# EasyEDA Pro project ProPrj_主稳压电路_2025-12-27.epro, board PCB7
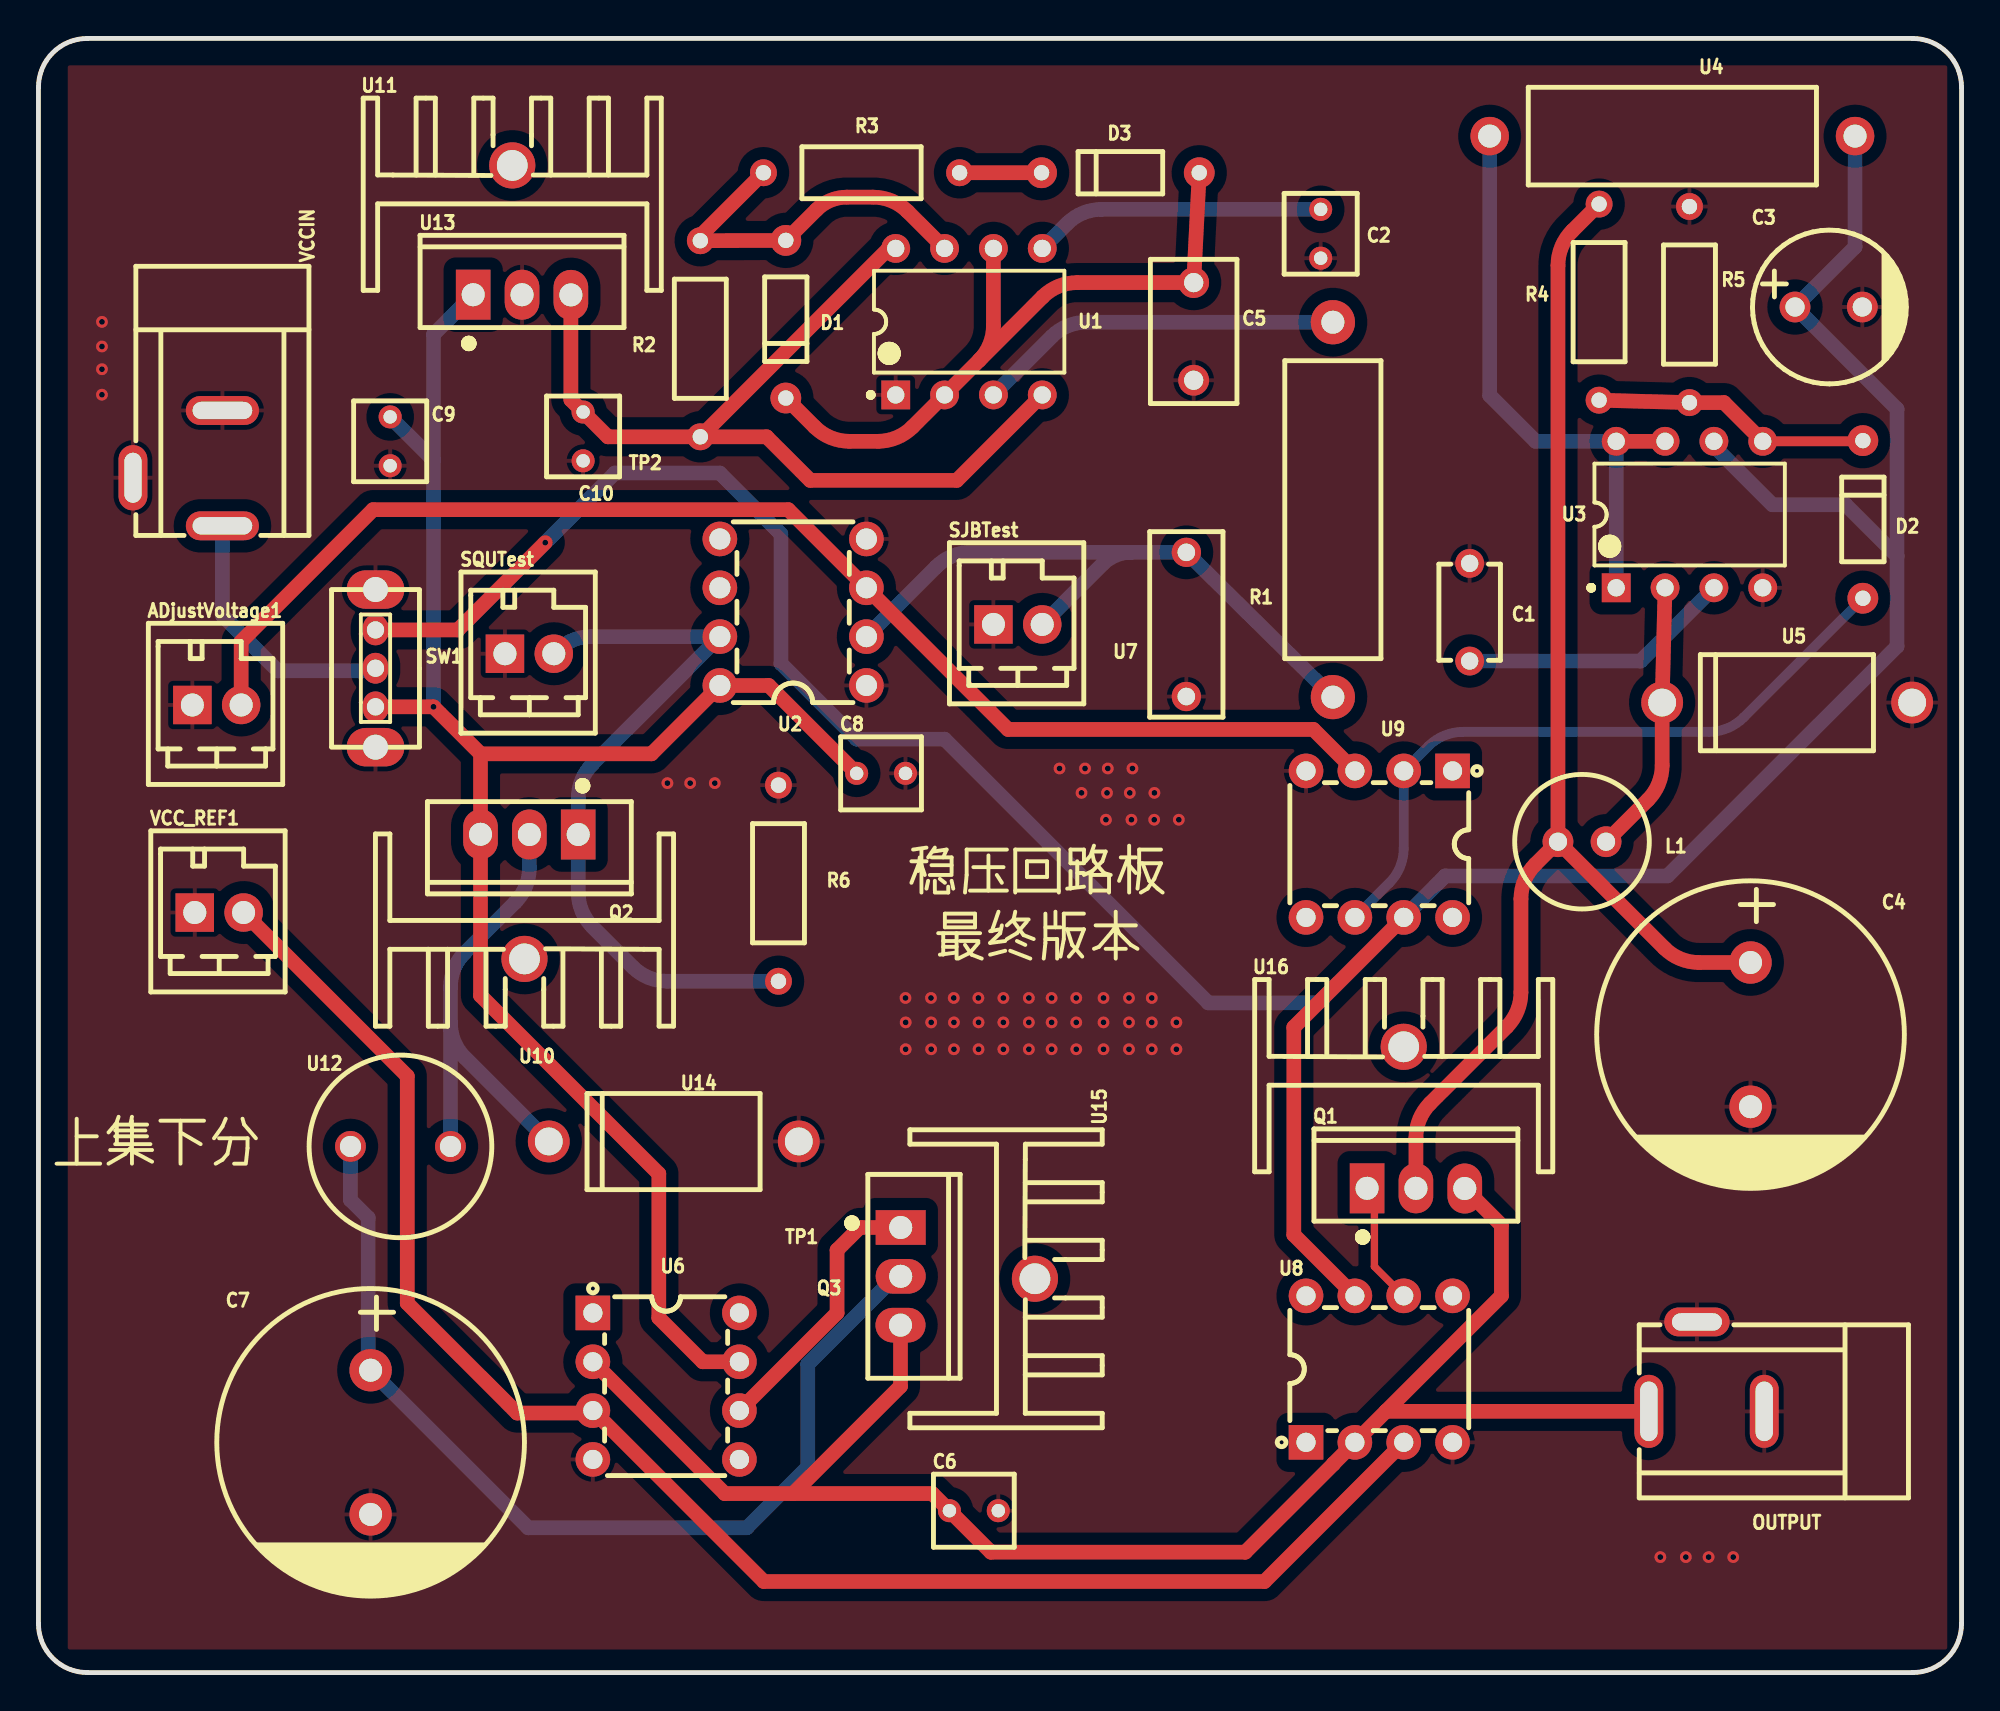
[diagram p5: board, top side]
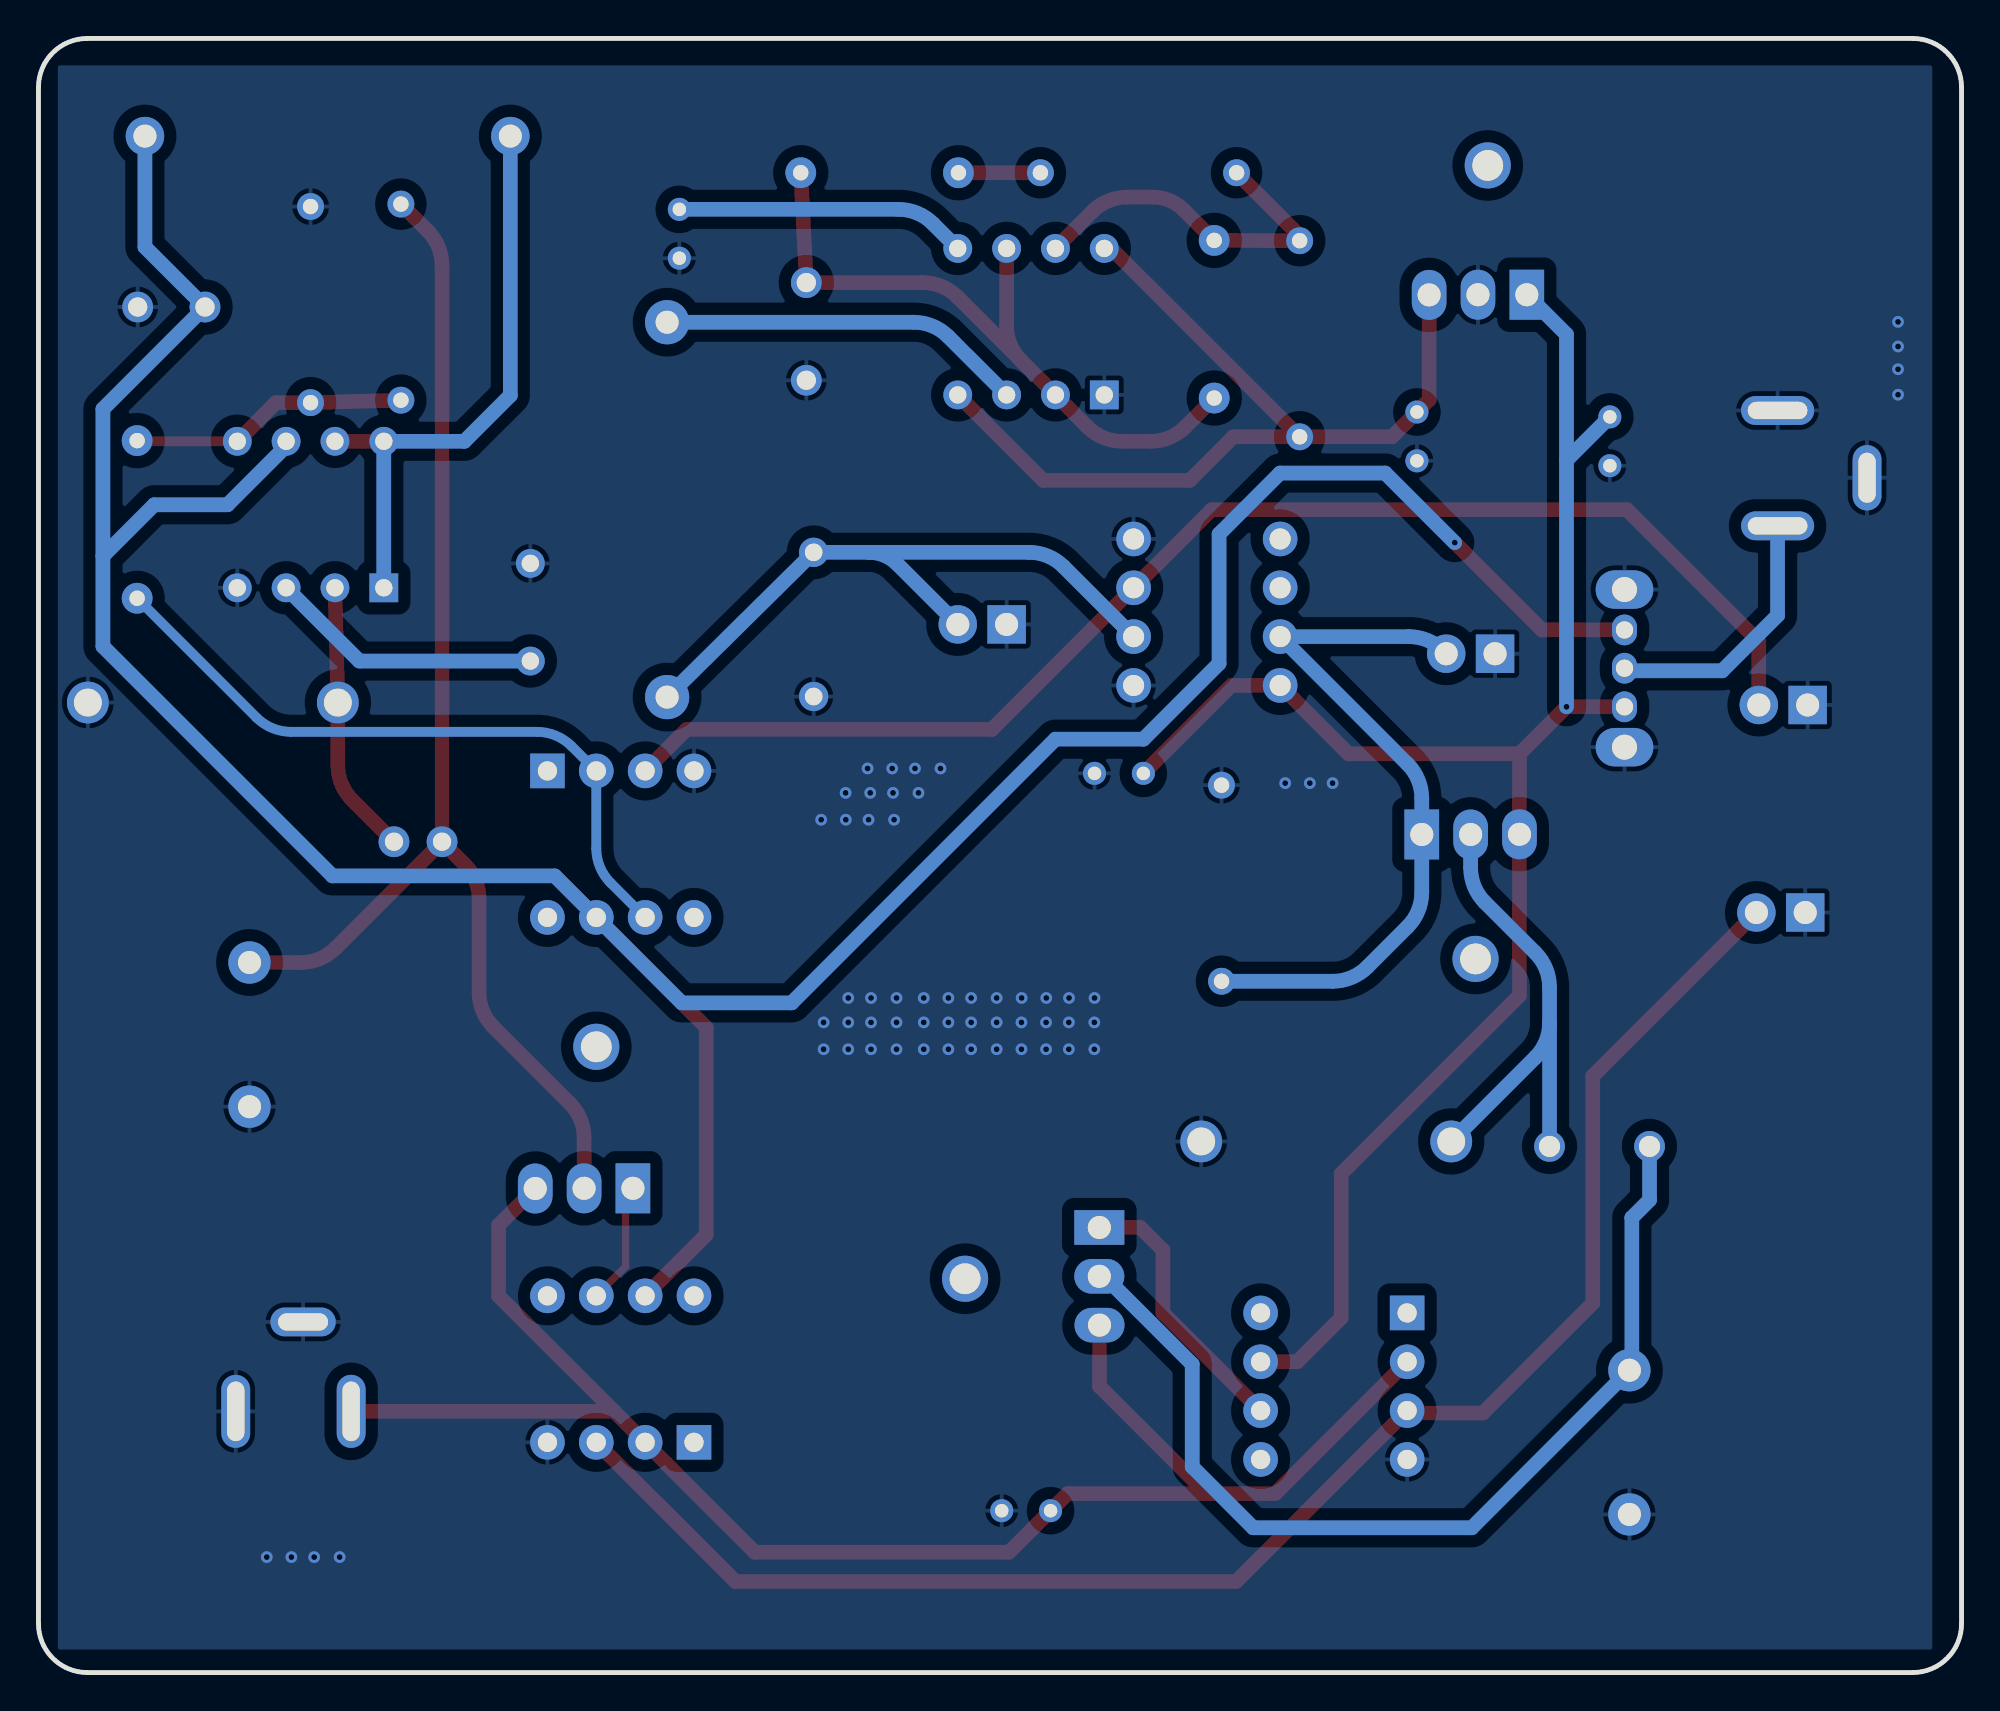
[diagram p6: board, bottom side, seen from below]

Outline 100 x 85 mm; copper layers: Top Layer, Bottom Layer. Coordinates in mm from the lower left corner of the outline.
Outline path: 0,82.46 0,2.54 arc(0.74,0.74) 2.54,0 97.46,0 arc(99.26,0.74) 100,2.54 100,82.46 arc(99.26,84.26) 97.46,85 2.54,85 arc(0.74,84.26) 0,82.46
Stack: Top Layer 0.035mm / Dielectric1 1.51mm FR4 er 4.5 / Bottom Layer 0.035mm

## Design rules (mm)
spacing copperThickness1oz (default): track to track 0.508, other pairs 0.152 to 0.3
spacing copperThickness2oz: track to track 0.203, other pairs 0.152 to 0.3
spacing Plane_innerPlane: track to track 0.508, other pairs 0.152 to 0.3
spacing Copper_copperRegion: track to track 0.508, other pairs 0.152 to 0.3
track width copperThickness1oz (default): min 0.381, default 0.508, max 2.54
track width copperThickness2oz: min 0.203, default 0.254, max 2.54
track width CU: min 0.762, default 0.762, max 0.762
differential pair differentialPair (default): width min 0.127, default 0.254, max 2.54; gap min 0.152, default 0.152
net ADJ uses CU
net VCCF34 uses CU
net OUT uses CU
net VCCF1 uses CU
net SQU uses CU
net SJB uses CU
net REF uses CU
net VCC uses CU
pour e256 uses Copper_copperRegion
pour e367 uses Copper_copperRegion

## Placement (name value [footprint] x y rotation side)
ADjustVoltage1  DB2EK-2.54-2P-GN-S  [CONN-TH_2P-P2.54_DB2EK-2.54-2P-GN]  9.27 50.33 0 top
C1  470pF  [CAP-TH_L5.0-W3.2-P5.08-D0.6]  74.42 55.16 270 top
C2  10nF  [CAP-TH_L4.2-W3.8-P2.54-D0.5]  66.68 74.84 270 top
C3  220uF  [CAP-TH_BD8.0-P3.50-D0.5-FD]  93.09 71.03 0 top
C4  2200uF  [CAP-TH_BD16.0-P7.50-D0.8-FD]  89.03 33.18 270 top
C5  120nF  [CAP-TH_L7.5-W4.5-P5.00-D0.5]  60.07 69.76 270 top
C6  10nF  [CAP-TH_L4.2-W3.8-P2.54-D0.5]  48.64 8.42 0 top
C7  2200uF  [CAP-TH_BD16.0-P7.50-D0.8-FD]  17.27 11.97 270 top
C8  10nF  [CAP-TH_L4.2-W3.8-P2.54-D0.5]  43.81 46.77 0 top
C9  10nF  [CAP-TH_L4.2-W3.8-P2.54-D0.5]  18.29 64.05 270 top
C10  10nF  [CAP-TH_L4.2-W3.8-P2.54-D0.5]  28.32 64.3 270 top
D1  1N4148TR  [DO-35_BD2.0-L4.2-P8.20-D0.5-RD]  38.86 70.39 90 top
D2  1N4148TR  [DO-35_BD2.0-L4.2-P8.20-D0.5-RD]  94.87 59.98 270 top
D3  1N4148TR  [DO-35_BD2.0-L4.2-P8.20-D0.5-RD]  56.26 78.02 0 top
L1  220uH  [IND-TH_BD7.0-P2.50-D0.7]  80.26 43.22 180 top
OUTPUT  DC-005-A200  [DC-IN-TH_DC-005-A200]  86.74 15.91 180 top
Q1  TIP122G  [TO-220-3_L10.0-W4.5-P2.54-L]  71.63 25.18 0 top
Q2  IRF9Z34NPBF  [TO-220-3_L10.0-W4.5-P2.54-L]  25.53 43.6 180 top
Q3  TIP122  [TO-220-3_L10.0-W4.5-P2.54-L]  44.83 20.61 270 top
R1  100Ω  [RES-TH_BD5.0-L15.5-P19.50-D0.8]  67.31 60.49 90 top
R2  1kΩ  [RES-TH_BD2.7-L6.2-P10.20-D0.4]  34.42 69.38 270 top
R3  1kΩ  [RES-TH_BD2.7-L6.2-P10.20-D0.4]  42.8 78.02 180 top
R4  15kΩ  [RES-TH_BD2.7-L6.2-P10.20-D0.4]  81.15 71.28 270 top
R5  1kΩ  [RES-TH_BD2.7-L6.2-P10.20-D0.4]  85.85 71.16 270 top
R6  1kΩ  [RES-TH_BD2.7-L6.2-P10.20-D0.4]  38.48 41.06 90 top
SJBTest  DB2EK-2.54-2P-GN-S  [CONN-TH_2P-P2.54_DB2EK-2.54-2P-GN]  50.93 54.52 0 top
SQUTest  DB2EK-2.54-2P-GN-S  [CONN-TH_2P-P2.54_DB2EK-2.54-2P-GN]  25.53 53 0 top
SW1  SS-12D02-VG4  [SW-TH_SS-12D02-VG4]  17.53 52.23 270 top
TP1  -  [Test-Point-0.5mm]  41.53 21.98 0 top
TP2  -  [Test-Point-0.5mm]  29.66 64.27 0 top
U1  NE555P  [DIP-8_L9.8-W6.6-P2.54-LS7.6-BL]  48.39 70.27 0 top
U2  LM311N/NOPB  [PDIP-8_L9.3-W6.4-P2.54-LS7.6-BL]  39.24 55.16 90 top
U3  MC34063ECN  [DIP-8_L9.8-W6.6-P2.54-LS7.6-BL]  85.85 60.23 0 top
U4  330mΩ  [RES-TH_BD5.0-L15.0-P19.00-D0.7]  84.96 79.92 180 top
U5  1N5825  [DO-201AD_BD5.0-L9.0-P13.00-D1.0]  90.93 50.46 0 top
U6  LM741N  [DIP-8_L9.3-W6.4-P2.54-LS7.6-BL]  32.64 14.9 270 top
U7  500nF  [CAP-TH_L9.5-W3.7-P7.50-D0.5]  59.69 54.52 90 top
U8  LM741N  [DIP-8_L9.3-W6.4-P2.54-LS7.6-BL]  69.72 15.78 0 top
U9  LM741N  [DIP-8_L9.3-W6.4-P2.54-LS7.6-BL]  69.72 43.09 180 top
U10  15.5*10.5*24  [HEATSINK-TH_L15.5-W10.5-XSD1226-005]  25.27 37.12 180 top
U11  15.5*10.5*24  [HEATSINK-TH_L15.5-W10.5-XSD1226-005]  24.64 78.4 0 top
U12  1mH  [IND-TH_BD9.5-P5.20-D0.6]  18.82 27.37 180 top
U13  LM7815T  [TO-220-3_L10.0-W4.5-P2.54-L]  25.15 71.67 0 top
U14  1N5825  [DO-201AD_BD5.0-L9.0-P13.00-D1.0]  33.04 27.63 0 top
U15  15.5*10.5*24  [HEATSINK-TH_L15.5-W10.5-XSD1226-005]  51.82 20.48 270 top
U16  15.5*10.5*24  [HEATSINK-TH_L15.5-W10.5-XSD1226-005]  70.99 32.55 0 top
VCC_REF1  DB2EK-2.54-2P-GN-S  [CONN-TH_2P-P2.54_DB2EK-2.54-2P-GN]  9.4 39.53 0 top
VCCIN  DC-005-A200  [DC-IN-TH_DC-005-A200]  7.24 62.65 270 top

## Footprints (pads in the part's own frame, mm; a bottom-side part is the same pattern mirrored in y, then rotated)
CAP-TH_BD8.0-P3.50-D0.5-FD
  round 1.6 hole 1: 1(-1.75,0) 2(1.75,0)
CAP-TH_BD16.0-P7.50-D0.8-FD
  round 2.2 hole 1.2: 1(-3.75,0) 2(3.75,0)
CAP-TH_L4.2-W3.8-P2.54-D0.5
  round 1.2 hole 0.7: 1(-1.27,0) 2(1.27,0)
CAP-TH_L5.0-W3.2-P5.08-D0.6
  round 1.5 hole 0.9: 1(-2.54,0) 2(2.54,0)
CAP-TH_L7.5-W4.5-P5.00-D0.5
  round 1.6 hole 1: 1(-2.54,0) 2(2.54,0)
CAP-TH_L9.5-W3.7-P7.50-D0.5
  round 1.524 hole 0.914: 1(-3.75,0) 2(3.75,0)
CONN-TH_2P-P2.54_DB2EK-2.54-2P-GN
  rect 2x2 hole 1.2: 1(-1.27,0)
  round 2 hole 1.2: 2(1.27,0)
DC-IN-TH_DC-005-A200
  oval 1.5x3.8 hole 0.9x3.1: 1(3,2.325) 2(-3,2.325)
  oval 3.4x1.5 hole 2.6x0.9: 3(0.5,-2.325)
DIP-8_L9.3-W6.4-P2.54-LS7.6-BL
  rect 1.8x1.8 hole 1: 1(-3.81,-3.81)
  round 1.8 hole 1: 2(-1.27,-3.81) 3(1.27,-3.81) 4(3.81,-3.81) 5(3.81,3.81) 6(1.27,3.81) 7(-1.27,3.81) 8(-3.81,3.81)
DIP-8_L9.8-W6.6-P2.54-LS7.6-BL
  rect 1.5x1.5 hole 0.9: 1(-3.81,-3.81)
  round 1.5 hole 0.9: 2(-1.27,-3.81) 3(1.27,-3.81) 4(3.81,-3.81) 5(3.81,3.81) 6(1.27,3.81) 7(-1.27,3.81) 8(-3.81,3.81)
DO-35_BD2.0-L4.2-P8.20-D0.5-RD
  round 1.6 hole 0.8: 1(-4.1,0) 2(4.1,0)
DO-201AD_BD5.0-L9.0-P13.00-D1.0
  round 2.175 hole 1.45: 1(-6.5,0) 2(6.5,0)
HEATSINK-TH_L15.5-W10.5-XSD1226-005
  round 2.4 hole 1.6: 1(0,0)
IND-TH_BD7.0-P2.50-D0.7
  round 1.6 hole 0.95: 1(-1.25,0) 2(1.25,0)
IND-TH_BD9.5-P5.20-D0.6
  round 1.6 hole 1.1: 1(-2.6,0) 2(2.6,0)
PDIP-8_L9.3-W6.4-P2.54-LS7.6-BL
  round 1.8 hole 1.1: 1(-3.81,-3.81) 2(-1.27,-3.81) 3(1.27,-3.81) 4(3.81,-3.81) 5(3.81,3.81) 6(1.27,3.81) 7(-1.27,3.81) 8(-3.81,3.81)
RES-TH_BD2.7-L6.2-P10.20-D0.4
  round 1.4 hole 0.8: 1(-5.1,0) 2(5.1,0)
RES-TH_BD5.0-L15.0-P19.00-D0.7
  round 2 hole 1.2: 1(-9.5,0) 2(9.5,0)
RES-TH_BD5.0-L15.5-P19.50-D0.8
  round 2.3 hole 1.2: 1(-9.75,0) 2(9.75,0)
SW-TH_SS-12D02-VG4
  oval 1.6x1.3 hole 0.9: 1(-2,0) 2(-0.006,0) 3(2,0)
  oval 2x3 hole 1.3: 4(4.1,0) 5(-4.1,0)
Test-Point-0.5mm
  round 0.5 smd: 1(0,0)
TO-220-3_L10.0-W4.5-P2.54-L
  rect 1.8x2.6 hole 1.2: 1(-2.54,0.005)
  oval 1.8x2.6 hole 1.2: 2(0,0.005) 3(2.54,-0.005)

## Nets
As in the schematic.

Pads without a net: U2 5 6; U6 1 5 8; U8 1 5 8; U9 1 5 8; U10 1; U11 1; U15 1; U16 1

## Via types
v1: diameter 0.61, hole 0.305, Top Layer to Bottom Layer, 60 vias

## Routing (per net, layer and track width the routed paths; a pad name or vN(x,y) marks a point on that pad's centre or on a via; arc(x,y) is an arc through that point)
GND:
  vias: v1(3.3,70.26) v1(3.3,68.98) v1(3.3,67.79) v1(3.3,66.47) v1(32.7,46.27) v1(33.89,46.27) v1(35.17,46.27) v1(45.09,35.09) v1(45.09,33.82) v1(45.09,32.42) v1(46.41,35.09) v1(46.42,33.82) v1(46.42,32.42) v1(47.59,35.09) v1(47.6,33.82) v1(47.6,32.42) v1(48.88,35.09) v1(48.88,33.82) v1(48.88,32.42) v1(50.18,35.09) v1(50.18,33.82) v1(50.18,32.42) v1(51.5,35.09) v1(51.5,33.82) v1(51.5,32.42) v1(52.68,35.09) v1(52.68,33.82) v1(52.68,32.42) v1(53.1,47.03) v1(53.97,35.09) v1(53.97,33.82) v1(53.97,32.42) v1(54.24,45.76) v1(54.42,47.03) v1(55.38,35.09) v1(55.38,33.82) v1(55.38,32.42) v1(55.51,44.36) v1(55.61,47.03) v1(55.56,45.76) v1(56.75,45.76) v1(56.71,35.09) v1(56.71,33.82) v1(56.71,32.42) v1(56.83,44.36) v1(56.89,47.03) v1(57.89,35.09) v1(57.89,33.82) v1(57.89,32.42) v1(58.03,45.76) v1(58.02,44.36) v1(59.17,33.82) v1(59.17,32.42) v1(59.3,44.36) v1(84.34,6.01) v1(85.66,6.01) v1(86.85,6.01) v1(88.13,6.01)
VCC: length 13.9
  Bottom Layer w0.762: VCCIN.1 9.56,54.99 12.45,52.11 17.39,52.11 SW1.2
VCCF1: length 93.2
  Top Layer w0.762: 22.99,47.79 v1(20.54,50.23) SW1.3 ; 22.99,47.79 Q2.3 22.99,35.22 32.26,25.94 32.26,18.45 34.54,16.17 U6.7 ; 22.99,47.79 31.88,47.79 U2.8 37.97,51.34 C8.1
  Bottom Layer w0.762: 20.54,63.06 C9.1 ; 20.54,63.06 v1(20.54,50.23) ; 20.54,63.06 20.54,69.61 U13.1
VCCF34: length 171.1
  Top Layer w0.762: SW1.1 21.81,54.23 v1(26.35,58.77) ; 70.99,39.28 65.28,33.56 65.28,22.77 U8.7
  Bottom Layer w0.762: U3.6 87.12,63.79 90.17,60.74 93.98,60.74 96.65,58.08 ; 96.65,58.08 96.65,65.72 C3.1 94.46,74.15 U4.1 ; 96.65,58.08 96.65,53.38 84.71,41.44 73.15,41.44 66.55,34.83 60.83,34.83 47.12,48.55 42.54,48.55 38.61,52.49 38.61,59.22 35.43,62.39 29.97,62.39 v1(26.35,58.77)
ADJ: length 69.7
  Top Layer w0.762: U9.3 66.29,49.06 50.42,49.06 U2.3 38.99,60.49 17.4,60.49 10.54,53.63 ADjustVoltage1.2
BAS: length 14.2
  Top Layer w0.762: U6.6 41.53,18.7 TP1.1 42.7,23.15 Q3.1
DIS: length 19.4
  Top Layer w0.762: R3.2 34.42,74.73 R2.1 38.86,74.5 40.46,76.09 arc(41.18,76.57) 42.04,76.75 43.4,76.75 arc(44.37,76.55) 45.19,76 U1.7
OUT: length 88
  Top Layer w0.762: Q1.3 76.07,23.27 76.07,19.59 70.06,13.59 ; 70.06,13.59 OUTPUT.1 ; 70.06,13.59 U8.2 67.35,10.87 67.35,10.85 62.75,6.26 49.53,6.26 46.48,9.31 39.24,9.31 ; 39.24,9.31 44.83,14.89 Q3.3 ; 39.24,9.31 35.69,9.31 U6.2
REF: length 84.8
  Top Layer w0.762: 70.99,11.97 63.75,4.74 37.72,4.74 U6.3 28.7,13.5 24.89,13.5 19.18,19.21 19.18,31.03 VCC_REF1.2
SJB: length 35.1
  Bottom Layer w0.762: U2.2 46.69,57.53 arc(47.52,58.08) 48.49,58.27 56.83,58.27 ; SJBTest.2 55.33,57.65 arc(56.01,58.11) 56.83,58.27 ; 56.83,58.27 U7.2 R1.1
SQU: length 37.9
  Bottom Layer w0.762: R6.1 32.69,35.96 arc(31.72,36.15) 30.9,36.7 28.81,38.79 arc(28.26,39.61) 28.07,40.59 Q2.1 28.07,45.47 arc(28.26,46.44) 28.81,47.26 U2.7 28.74,53.89 arc(27.77,53.69) 26.94,53.14 SQUTest.2
TRI: length 37
  Top Layer w0.762: D1.1 40.37,64.79 arc(41.19,64.24) 42.16,64.05 43.65,64.05 arc(44.62,64.24) 45.45,64.79 U1.2 48.91,68.25 ; U1.6 49.66,70.05 arc(49.46,69.08) 48.91,68.25 ; D3.2 C5.1 54.01,72.3 arc(53.04,72.11) 52.22,71.56 48.91,68.25
VC15: length 47.8
  Top Layer w0.762: R2.2 29.61,64.28 C10.1 27.69,66.2 U13.3 ; R2.2 44.22,74.08 U1.8 ; R2.2 37.87,64.28 40.13,62.01 47.75,62.01 U1.4
$1N5771: length 19.1
  Bottom Layer w0.762: R1.2 54.49,70.24 arc(53.52,70.05) 52.69,69.5 U1.3
$1N5830: length 15.2
  Bottom Layer w0.762: C2.1 55.28,76.11 arc(54.31,75.92) 53.49,75.37 U1.5
$1N6011: length 4.3
  Top Layer w0.762: R3.1 D3.1
$1N11989: length 51.6
  Bottom Layer w0.762: U12.2 16.22,24.58 17.14,23.66 17.14,15.85 C7.1 25.47,7.53 36.83,7.53 40,10.71 40,16.04 44.58,20.61 Q3.2
$1N12066: length 25.9
  Bottom Layer w0.762: Q2.2 25.53,41.86 arc(25.33,40.88) 24.78,40.06 22.17,37.44 arc(21.62,36.62) 21.42,35.65 21.42,33.79 ; 21.42,33.79 U12.1 ; 21.42,33.79 arc(21.62,32.82) 22.17,31.99 U14.1
$1N13805: length 31.2
  Top Layer w0.762: U3.7 U3.8
  Bottom Layer w0.762: U4.2 75.46,66.43 77.85,64.05 U3.8 U3.1
$1N13870: length 14.3
  Bottom Layer w0.762: U3.3 83.31,52.61 C1.2
$1N14029: length 14.3
  Top Layer w0.762: U3.2 U5.1 84.43,47.19 arc(84.24,46.21) 83.69,45.39 L1.1
$1N14605: length 35.9
  Bottom Layer w0.508: D2.2 88.66,49.68 arc(87.84,49.13) 86.87,48.93 74.08,48.93 arc(73.1,48.74) 72.28,48.19 70.99,46.9 70.99,42.87 arc(70.8,41.9) 70.25,41.08 U9.6
$1N14798: length 14.6
  Top Layer w0.508: U3.5 94.83,64.05 D2.1
  Top Layer w0.762: R4.2 R5.2 87.65,66.06 U3.5
$1N14804: length 67.2
  Top Layer w0.762: Q1.2 71.63,27.81 arc(71.82,28.79) 72.37,29.61 76.34,33.58 arc(76.9,34.41) 77.09,35.38 77.09,40.24 arc(77.28,41.21) 77.83,42.04 L1.2 ; L1.2 84.55,37.68 arc(85.38,37.13) 86.35,36.93 C4.1 ; L1.2 79.01,73.19 arc(79.21,74.17) 79.76,74.99 R4.1
$1N14946: length 6.4
  Top Layer w0.381: Q1.1 69.47,24.81 69.47,21.12 70.99,19.59

## Copper pours and planes (outline as drawn; the poured copper is in the pictures)
GND on Top Layer: 1.52,83.6 99.26,83.6 99.26,1.2 1.52,1.2
GND on Bottom Layer: 1.52,83.6 98.99,83.6 98.99,1.2 1.52,1.2

## Text on the board
Top Silkscreen Layer: 上集下分 | 稳压回路板 / 最终版本
